# EAGLE design Data East converter (EAGLE 9.6.2)
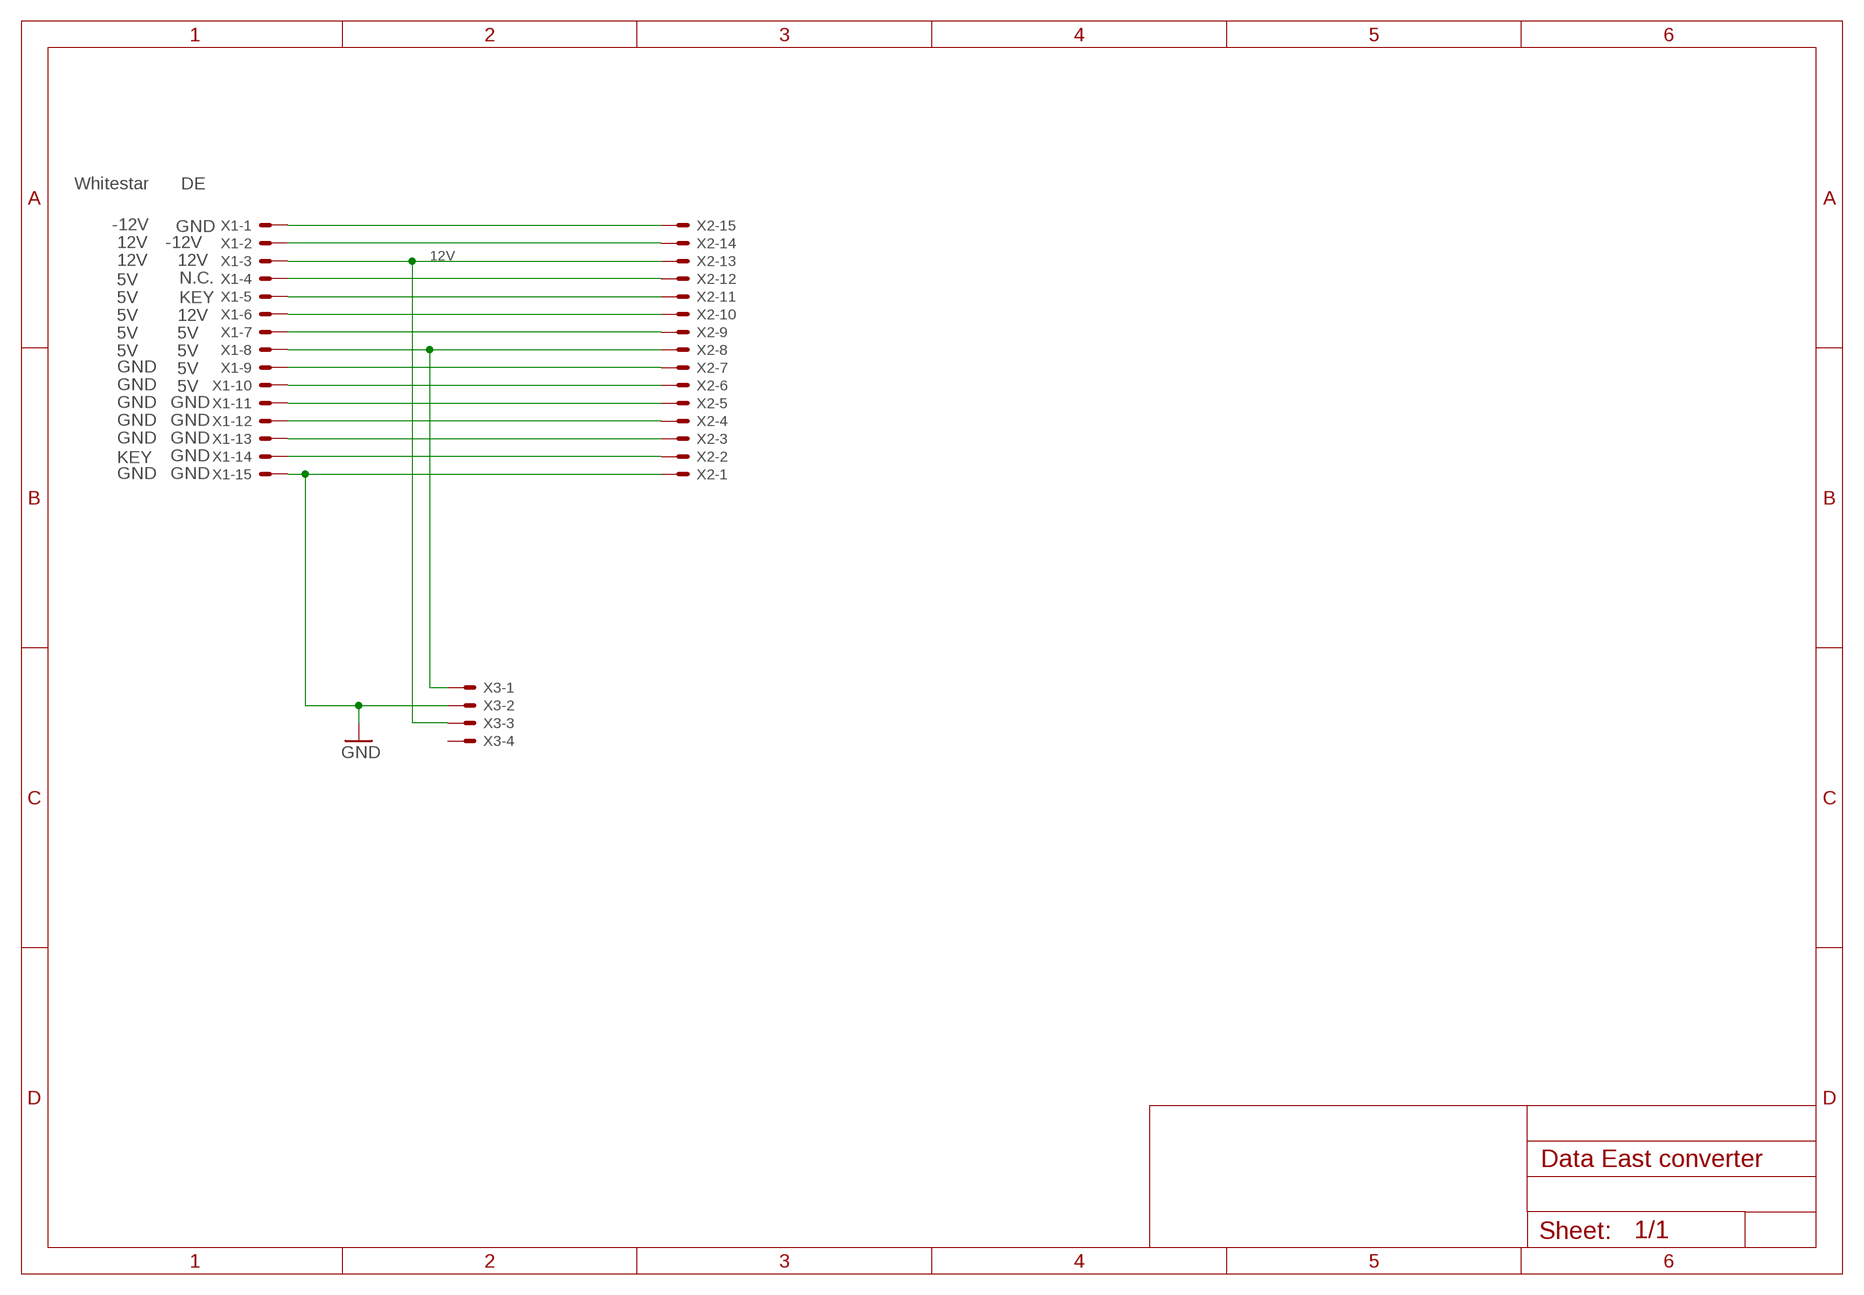
[diagram p0: schematic, sheet 1]

## Parts
X1  KK-156-15_FKK-156-15-F  [KK-156-15_F]
X2  KK-156-15  [KK-156-15]
X3  KK-156-4  [KK-156-4]

## Nets
12V: X1.3 X2.13 X3.3
GND: X1.15 X2.1 X3.2
N$1: X1.14 X2.2
N$2: X1.10 X2.6
N$3: X1.2 X2.14
N$4: X1.1 X2.15
N$5: X1.4 X2.12
N$6: X1.6 X2.10
N$7: X1.8 X2.8 X3.1
N$8: X1.7 X2.9
N$9: X1.9 X2.7
N$10: X1.5 X2.11
N$11: X1.13 X2.3
N$12: X1.12 X2.4
N$13: X1.11 X2.5
Unconnected: X3.4

## Notes on the sheet
- Whitestar | DE
- -12V | GND
- 12V | -12V
- 12V | 12V
- 5V | N.C.
- 5V | KEY
- 5V | 12V
- 5V | 5V
- 5V | 5V
- GND | 5V
- GND | 5V
- GND | GND
- GND | GND
- GND | GND
- KEY | GND
- GND | GND

## Library data of the parts
X1 = con-molex_KK-156-Horizontal:KK-156-15_F: KK 156 HEADER Source: http://www.molex.com/pdm_docs/sd/026604100_sd.pdf
X2 = con-molex_KK-156-Horizontal:KK-156-15: KK 156 HEADER Source: http://www.molex.com/pdm_docs/sd/026604100_sd.pdf; MF: MOLEX; OC_FARNELL: unknown; OC_NEWARK: unknown
X3 = con-molex:KK-156-4: KK 156 HEADER Source: http://www.molex.com/pdm_docs/sd/026604100_sd.pdf; MF: MOLEX; OC_FARNELL: unknown; OC_NEWARK: unknown

## Board
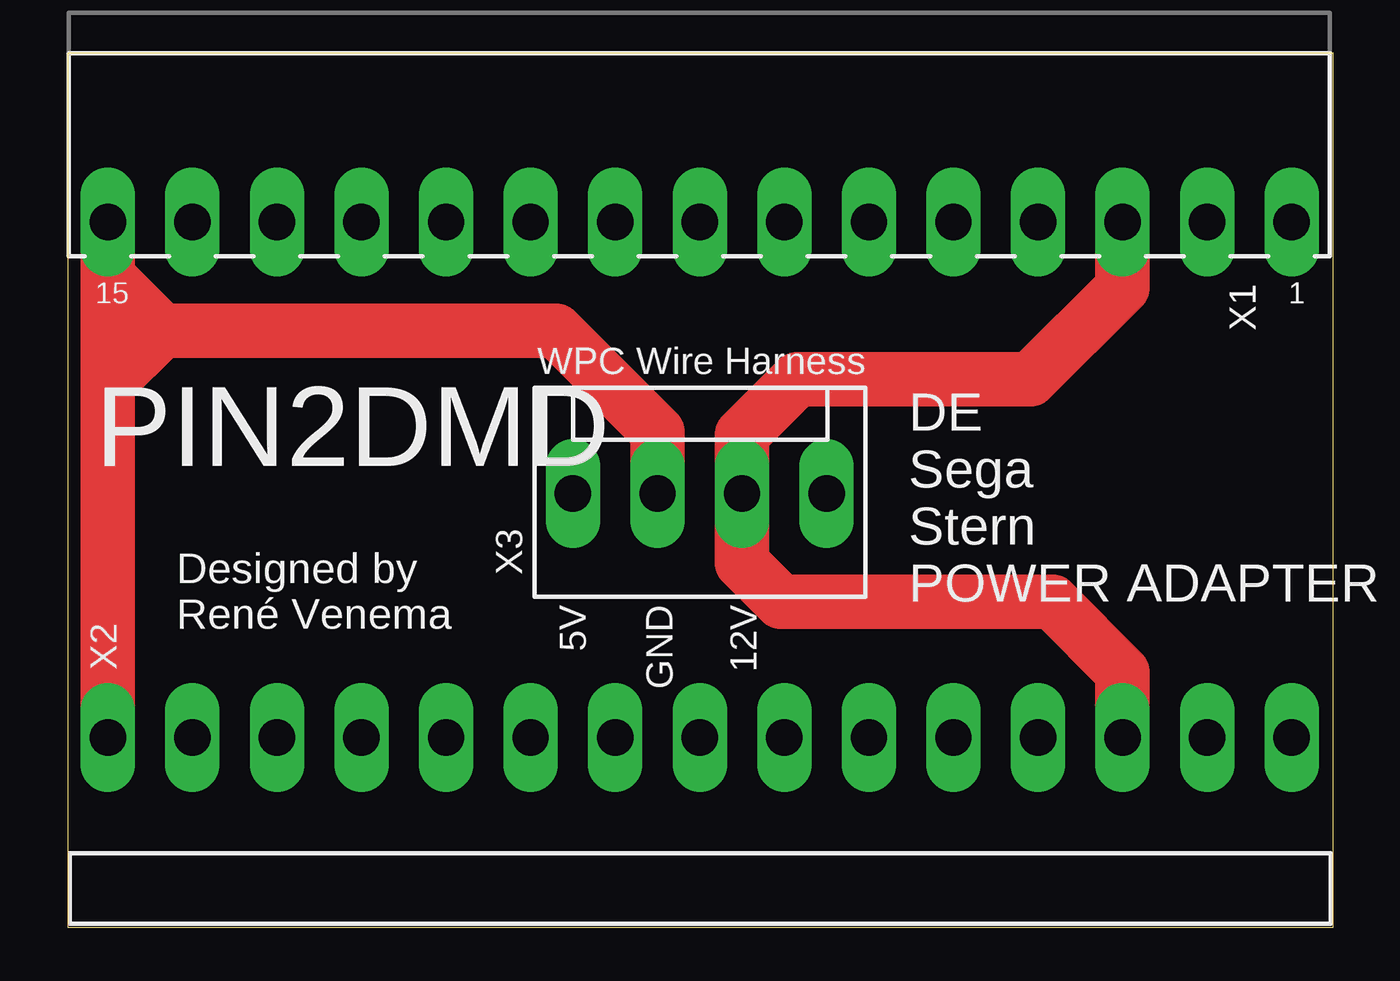
[diagram p1: board, top side]
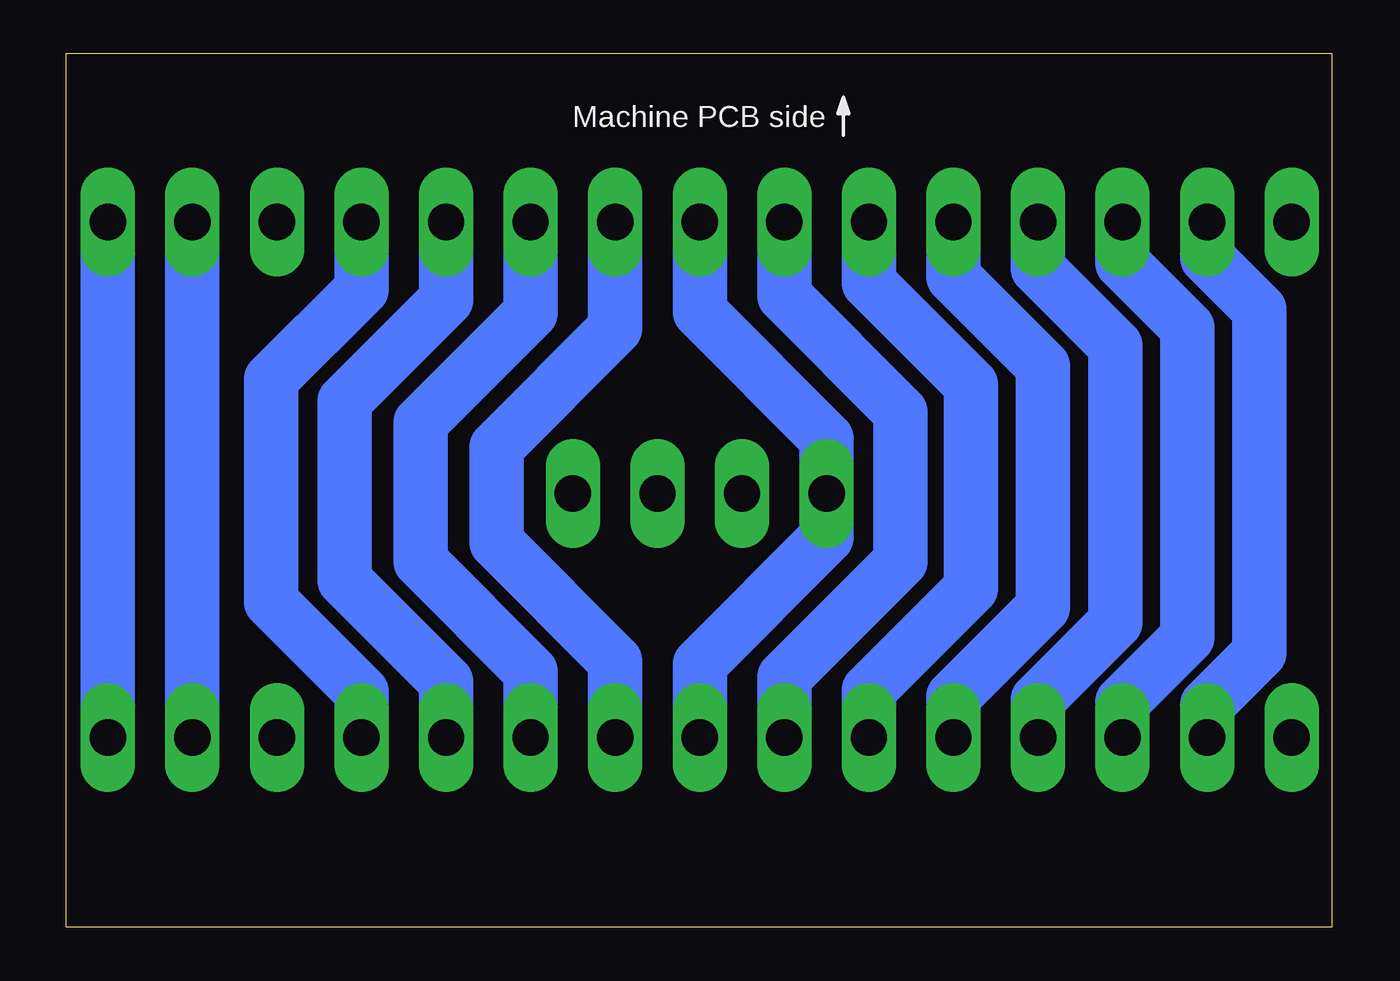
[diagram p2: board, bottom side, seen from below]

Size 59.25 x 40.92 mm. Coordinates in mm from the lower left corner, seen from the top.
Outline: 0,0 59.25,0 59.25,40.92 0,40.92 0,0
Copper layers (1*16): Top 0.035559375mm / dielectric 1.6mm / Bottom 0.035559375mm
Design rules "jlcpcb2layer": minimum track width 5mil, minimum drill 12mil, track to track 5mil, track to pad 5mil, pad to pad 5mil, via to via 5mil, smd to smd 5mil, copper to edge 8mil, drill to drill 6mil, minimum pad ring 5mil, minimum via ring 3mil, stop-mask expansion 2.5mil, vias tented up to drill 0mil, thermal gap 10mil

### Footprints (pad centres in the part's own frame; a part is rotated, then mirrored left to right if it is on the bottom)
KK-156-15_F = drill 1.7 pad 2.184 long: 1 -27.72,0; 2 -23.76,0; 3 -19.8,0; 4 -15.84,0; 5 -11.88,0; 6 -7.92,0; 7 -3.96,0; 8 0,0; 9 3.96,0; 10 7.92,0; 11 11.88,0; 12 15.84,0; 13 19.8,0; 14 23.76,0; 15 27.72,0
KK-156-15 = drill 1.7 pad 2.184 long: 1 -27.72,0; 2 -23.76,0; 3 -19.8,0; 4 -15.84,0; 5 -11.88,0; 6 -7.92,0; 7 -3.96,0; 8 0,0; 9 3.96,0; 10 7.92,0; 11 11.88,0; 12 15.84,0; 13 19.8,0; 14 23.76,0; 15 27.72,0
KK-156-4 = drill 1.7 pad 2.184 long: 1 -5.94,0; 2 -1.98,0; 3 1.98,0; 4 5.94,0

### Placement (x,y rotation side)
X1  29.59,33.02 180 top
X2  29.59,8.89 0 top
X3  29.59,20.32 0 top

### Tracks (layer width: path | path; a pad name or v marks a point on that pad's centre or on a via)
12V
  Top 2.54: X1.3 49.39,29.96 45.09,25.65 34.16,25.65 31.57,23.06 X3.3 31.57,17.07 33.4,15.24 46.1,15.24 49.39,11.95 X2.13
GND
  Top 2.54: X1.15 1.87,30.48 | 1.87,30.48 1.87,27.94 | 1.87,27.94 1.87,25.4 | 1.87,25.4 X2.1 | 1.87,27.94 4.41,27.94 | 4.41,27.94 22.86,27.94 27.61,23.19 X3.2 | 1.87,30.48 4.41,27.94 | 4.41,27.94 1.87,25.4
N$1
  Bottom 2.54: X1.14 5.83,31.36 3.38,28.91 3.38,12.87 5.83,10.42 X2.2
N$2
  Bottom 2.54: X2.6 21.67,11.1 16.89,15.88 16.89,25.4 21.67,30.18 X1.10
N$3
  Bottom 2.54: X1.2 X2.14
N$4
  Bottom 2.54: X1.1 X2.15
N$5
  Bottom 2.54: X1.4 45.43,29.88 49.66,25.65 49.66,15.24 45.43,11.01 X2.12
N$6
  Bottom 2.54: X1.6 37.51,28.78 42.67,23.62 42.67,17.14 37.51,11.98 X2.10
N$7
  Bottom 2.54: X1.8 29.59,28.83 23.65,22.89 X3.1 23.65,18.26 29.59,12.32 X2.8
N$8
  Bottom 2.54: X2.9 33.55,12.47 39.12,18.04 39.12,22.48 33.55,28.04 X1.7
N$9
  Bottom 2.54: X1.9 25.63,29.57 20.19,24.13 20.19,17.14 25.63,11.71 X2.7
N$10
  Bottom 2.54: X2.11 41.47,11.5 46.23,16.26 46.23,24.64 41.47,29.39 X1.5
N$11
  Bottom 2.54: X1.13 9.79,31.11 6.76,28.07 6.76,13.58 9.79,10.55 X2.3
N$12
  Bottom 2.54: X1.12 13.75,30.86 10.13,27.24 10.13,14.29 13.75,10.67 X2.4
N$13
  Bottom 2.54: X2.5 17.71,10.8 13.51,15 13.51,26.28 17.71,30.48 X1.11

### Text on the board
tPlace: 15 | 1 | WPC Wire Harness | PIN2DMD | 5V | GND | 12V | DE / Sega / Stern / POWER ADAPTER | Designed by / René Venema
bPlace: Machine PCB side
tDocu: JLCJLCJLCJLC